# Altium schematic sheet Block Diagram.SchDoc: Mixed Signal Board
size A4; Date: *******; ApprovedBy: *******; Author: *******; CompanyName: *******; DrawnBy: Imad khan; Engineer: *******; Organization: *******; Address1: *******; Address2: *******; Address3: *******; Address4: *******; DocumentNumber: 1; Revision: *******; SheetNumber: 1; SheetTotal: 11; CurrentTime: *******; CurrentDate: *******; Time: *******; DocumentFullPathAndName: *******; DocumentName: *******; ModifiedDate: *******; ImagePath: *******; ProjectName: *******; Application_BuildNumber: *******
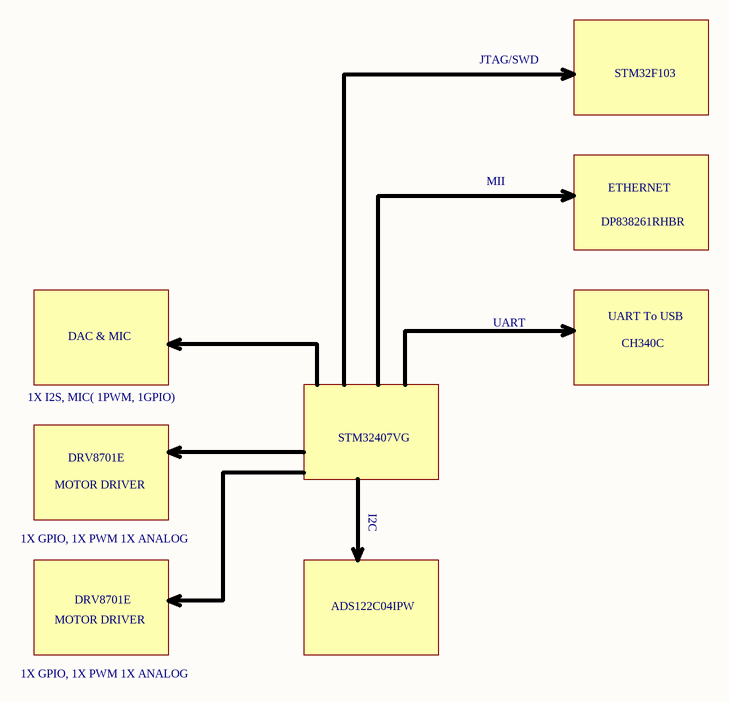
[diagram p0: Block Diagram.SchDoc]

## Notes on the sheet
- JTAG/SWD
- STM32F103
- MII
- DP838261RHBR
- ETHERNET
- DAC & MIC
- UART
- UART To USB
- CH340C
- 1X I2S, MIC( 1PWM, 1GPIO)
- MOTOR DRIVER
- DRV8701E
- STM32407VG
- 1X GPIO, 1X PWM 1X ANALOG
- I2C
- ADS122C04IPW
- Title:
- Drawn By:
- Page Contents:
- Checked By:
- Size:
- Date:
- File:
- License:
- Email:
- A4
- Number:
- Time:
- Revision:
- Sheet
- Website:
- of